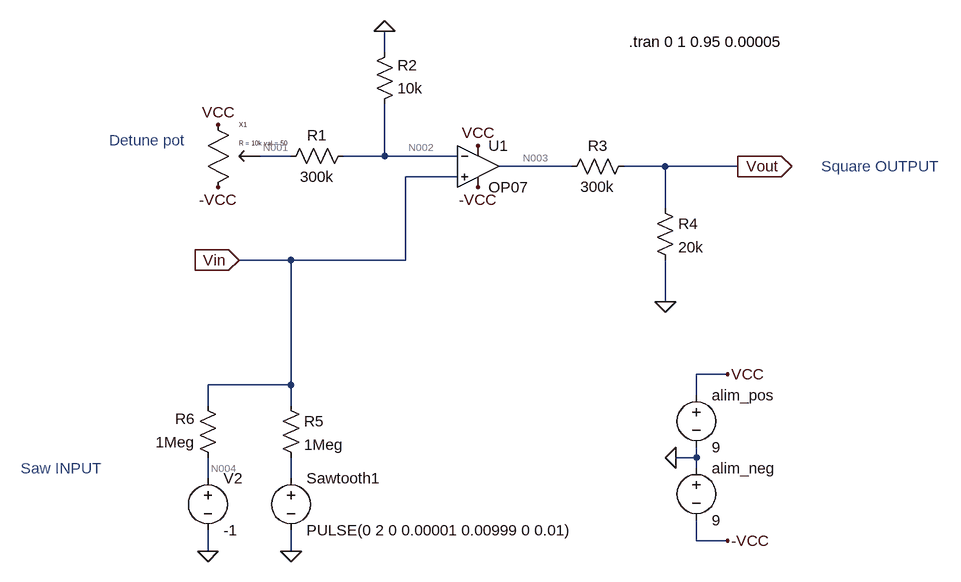
[diagram p0: schematic saw_to_square.asc]
saw_to_square.asc, the LTspice schematic file:
Version 4.1
SHEET 1 880 684
WIRE -432 -128 -432 -160
WIRE -576 32 -624 32
WIRE -432 32 -432 -48
WIRE -432 32 -496 32
WIRE -320 32 -432 32
WIRE -144 48 -256 48
WIRE 0 48 -64 48
WIRE 112 48 0 48
WIRE -320 64 -400 64
WIRE 0 112 0 48
WIRE -576 192 -656 192
WIRE -400 192 -400 64
WIRE -400 192 -576 192
WIRE 0 256 0 192
WIRE 96 368 48 368
WIRE -576 384 -576 192
WIRE -576 384 -704 384
WIRE 48 400 48 368
WIRE -704 416 -704 384
WIRE -576 416 -576 384
WIRE 48 496 48 480
WIRE 48 496 16 496
WIRE 48 512 48 496
WIRE -704 528 -704 496
WIRE -576 528 -576 496
WIRE 48 624 48 592
WIRE 96 624 48 624
WIRE -704 640 -704 608
WIRE -576 640 -576 608
FLAG 16 496 0
FLAG 96 368 VCC
FLAG 96 624 -VCC
FLAG -432 -160 0
FLAG -288 16 VCC
FLAG -288 80 -VCC
FLAG -656 192 Vin
IOPIN -656 192 In
FLAG -688 -16 VCC
FLAG -688 80 -VCC
FLAG 0 256 0
FLAG 112 48 Vout
IOPIN 112 48 Out
FLAG -576 640 0
FLAG -704 640 0
SYMBOL voltage 48 384 R0
SYMATTR InstName alim_pos
SYMATTR Value 9
SYMBOL voltage 48 496 R0
SYMATTR InstName alim_neg
SYMATTR Value 9
SYMBOL OpAmps\\OP07 -288 -16 R0
SYMATTR InstName U1
SYMBOL res -480 16 R90
WINDOW 0 0 56 VBottom 2
WINDOW 3 32 56 VTop 2
SYMATTR InstName R1
SYMATTR Value 300k
SYMBOL res -448 -32 M180
WINDOW 0 36 76 Left 2
WINDOW 3 36 40 Left 2
SYMATTR InstName R2
SYMATTR Value 10k
SYMBOL res -48 32 R90
WINDOW 0 0 56 VBottom 2
WINDOW 3 32 56 VTop 2
SYMATTR InstName R3
SYMATTR Value 300k
SYMBOL res -16 96 R0
SYMATTR InstName R4
SYMATTR Value 20k
SYMBOL pot -720 0 R0
WINDOW 39 64 12 Left 0
SYMATTR InstName X1
SYMATTR SpiceLine R = 10k val = 50
SYMBOL voltage -576 512 R0
WINDOW 123 0 0 Left 0
WINDOW 39 0 0 Left 0
SYMATTR InstName Sawtooth1
SYMATTR Value PULSE(0 2 0 0.00001 0.00999 0 0.01)
SYMBOL res -592 400 R0
SYMATTR InstName R5
SYMATTR Value 1Meg
SYMBOL res -688 512 R180
WINDOW 0 36 76 Left 2
WINDOW 3 36 40 Left 2
SYMATTR InstName R6
SYMATTR Value 1Meg
SYMBOL voltage -704 512 R0
SYMATTR InstName V2
SYMATTR Value -1
TEXT -856 8 Left 2 ;Detune pot
TEXT -992 512 Left 2 ;Saw INPUT
TEXT 240 48 Left 2 ;Square OUTPUT
TEXT -56 -144 Left 2 !.tran 0 1 0.95 0.00005

The netlist it stands for:
* saw_to_square.asc
V§alim_pos VCC 0 9
V§alim_neg 0 -VCC 9
X§U1 Vin N002 VCC -VCC N003 LT1001  ; OP07, pins In+ In- V+ V- OUT
R1 N002 N001 300k
R2 N002 0 10k
R3 Vout N003 300k
R4 Vout 0 20k
X§X1 VCC N001 -VCC pot R = 10k val = 50  ; pins 1 2 3
V§Sawtooth1 N005 0 PULSE(0 2 0 0.00001 0.00999 0 0.01)
R5 Vin N005 1Meg
R6 N004 Vin 1Meg
V2 N004 0 -1
* Detune pot
* Saw INPUT
* Square OUTPUT
.tran 0 1 0.95 0.00005
.lib LTC.lib
.backanno
.end

* Results of the author's LTspice run, read from the files saved beside the schematic
* Operating Point, zero values left out:
*   V(-vcc) = -9 V
*   V(n002) = -64.89 µV
*   V(n003) = -8.07 V
*   V(vout) = -504.3 mV
*   V(vcc) = 9 V
*   V(vin) = -496.6 mV
*   V(n001) = -536.3 nV
*   V(n004) = -1 V
*   I(alim_pos) = -4.041 mA
*   I(R2) = -6.489 nA
*   I(R4) = -25.22 µA
*   I(Sawtooth1) = -496.6 nA
*   I(V2) = 503.4 nA
*   I(alim_neg) = -4.059 mA
*   I(R3) = 25.22 µA
*   I(R5) = -496.6 nA
*   I(R6) = -503.4 nA
*   I(R1) = -214.5 pA
*   Ix(x1:1) = 1.8 mA
*   Ix(x1:2) = -214.5 pA
*   Ix(x1:3) = -1.8 mA
*   Ix(u1:1) = -6.705 nA
*   Ix(u1:2) = 6.704 nA
*   Ix(u1:3) = 2.241 mA
*   Ix(u1:4) = -2.259 mA
*   Ix(u1:5) = 25.22 µA
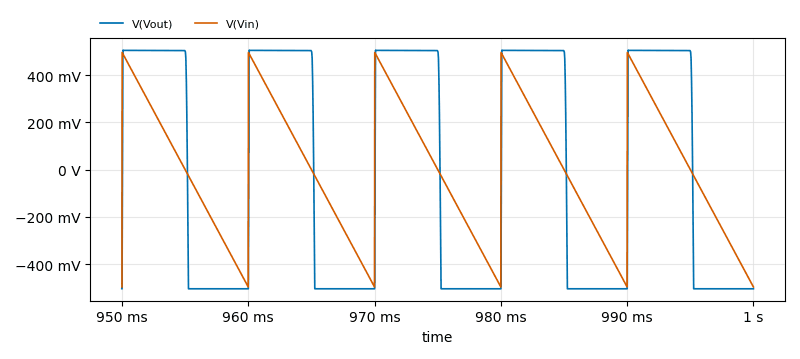
[diagram p1: Transient Analysis of saw_to_square.asc, plotted from the saved traces]
* Transient Analysis, 1 run:
*   V(Vout): min -504.4 mV, max 504.7 mV, average 13.39 mV, rms 500.4 mV, last -504.4 mV
*   V(Vin): min -496.5 mV, max 495.8 mV, average 2.169 µV, rms 331.9 mV, last -496.5 mV